# EasyEDA Pro project REF_Base.eprj

# Schematic Schematic1
Create Date: 2024-08-08; Page Name: P1; Project Name: REF_Base; Schematic Name: Schematic1; Update Date: 2024-08-25; Company: 嘉立创EDA; Drawed: XiaoHai; Page Size: A4; Reviewed: XiaoHai; Version: V1.0
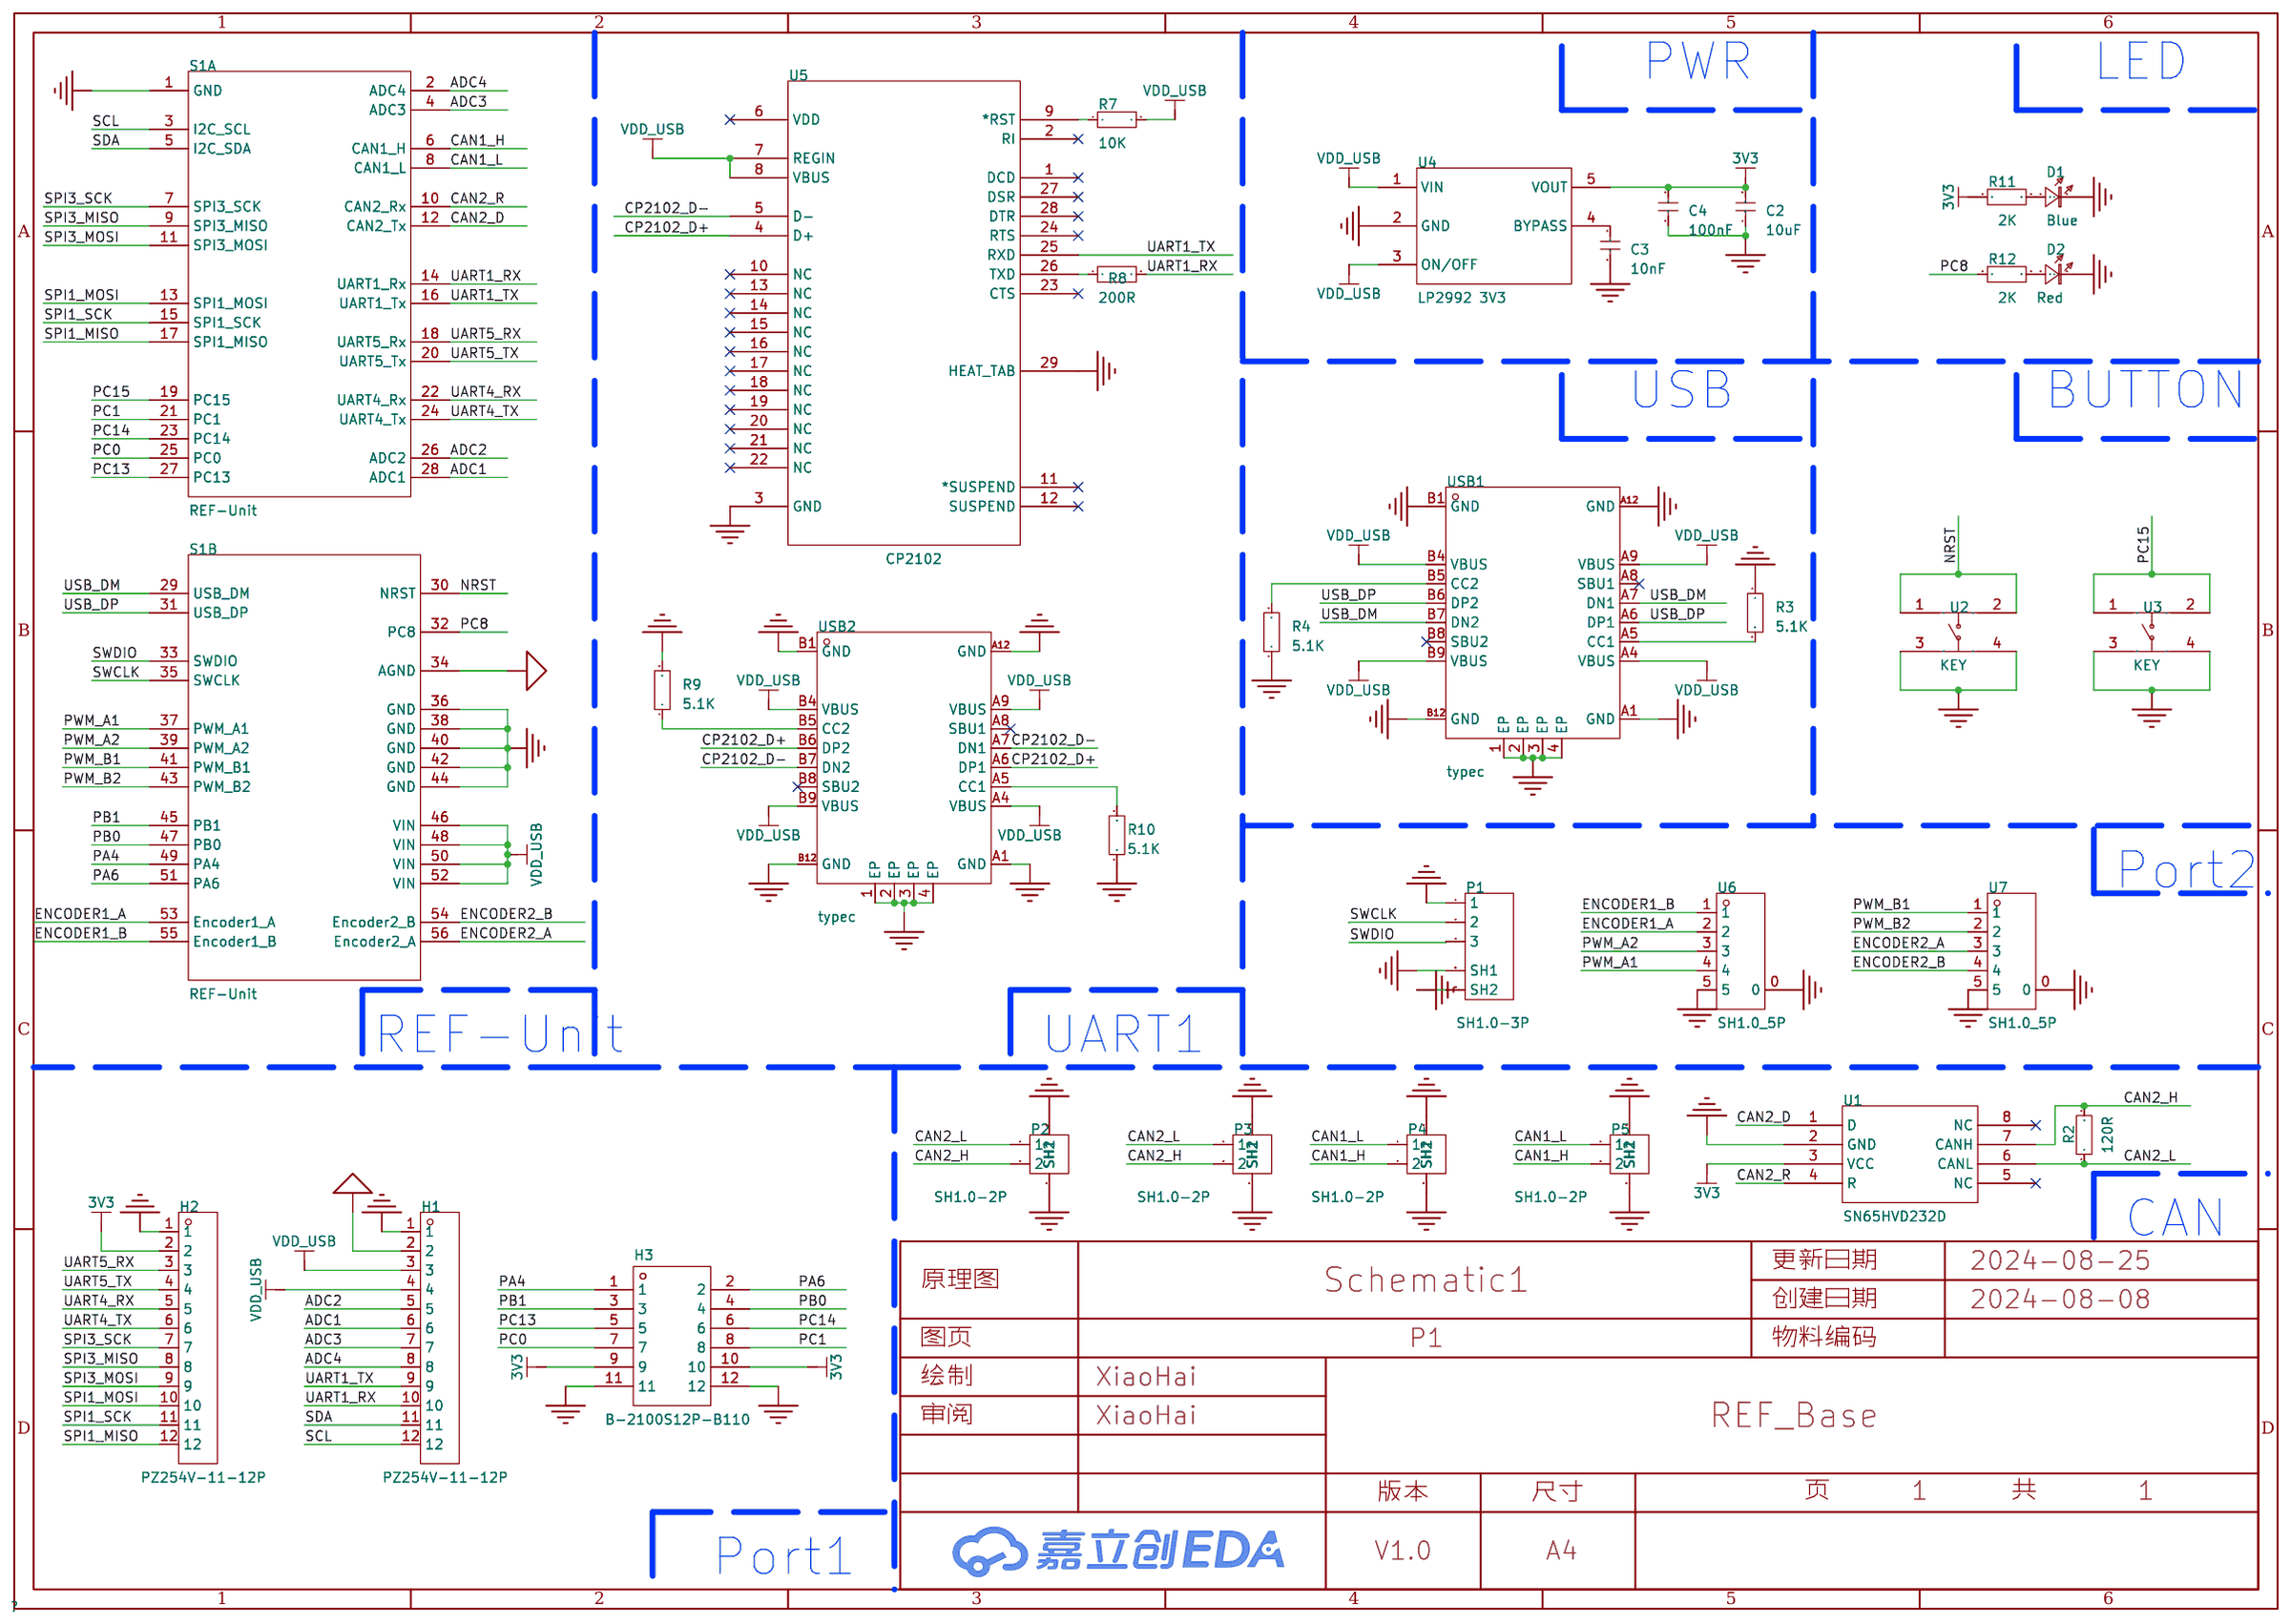
[diagram p0: schematic sheet]

## Parts
C2  0.1u  [CAP_0402]
C3  0.1u  [CAP_0402]
C4  0.1u  [CAP_0402]
D1  color?  [LED_0402_RED]
D2  color?  [LED_0402_RED]
H1  PZ254V-11-12P  [HDR-TH_12P-P2.54-V-M]
H2  PZ254V-11-12P  [HDR-TH_12P-P2.54-V-M]
H3  B-2100S12P-B110  [HDR-TH_12P-P2.54-V-M-R2-C6-S2.54]
P1  SH1.0-3P  [SH1.0-3P]
P2  SH1.0-2P  [SH1.0-2P]
P3  SH1.0-2P  [SH1.0-2P]
P4  SH1.0-2P  [SH1.0-2P]
P5  SH1.0-2P  [SH1.0-2P]
R2  22R  [RES_0402]
R3  22R  [RES_0402]
R4  22R  [RES_0402]
R7  22R  [RES_0402]
R8  22R  [RES_0402]
R9  22R  [RES_0402]
R10  22R  [RES_0402]
R11  22R  [RES_0402]
R12  22R  [RES_0402]
S1  REF-Unit  [REF-UNIT]  (sections 1,2)
U1  SN65HVD232D  [SO-8]
U2  KEY  [KEY-SMD_TSC4A]
U3  KEY  [KEY-SMD_TSC4A]
U4  LP2992 3V3  [SOT23-5]
U5  Value  [QFN-28]
U6  SH1.0_5P  [CONN-SMD_5P-SH1.00-5P-WT]
U7  SH1.0_5P  [CONN-SMD_5P-SH1.00-5P-WT]
USB1  typec  [USB-C-SMD_KH-TYPE-C-16P]
USB2  typec  [USB-C-SMD_KH-TYPE-C-16P]

## Library data of the parts
C2-C4 = 电容-0402
D1 D2 = LED_0402: Type: 0402; Origin Footprint 2: LED_0402_BLUE; Origin Footprint 3: LED_0402_ORANGE; Origin Footprint 4: LED_0402_YELLOW; Origin Footprint 5: LED_0402_GREEN
H1 H2 = PZ254V-11-12P: 插针结构:1x12P;间距:2.54mm;行距:-;圆针/方针:方针;安装类型:直插;排数:单排;总PIN位数:12P;额定电流:3A;额定电压:250V;配合针长度:6mm;塑高:2.5mm;端接针长度:3mm;触头材质:-;工作温度范围:-40℃~+105℃;颜色:黑色;; LCSC Part Name: 间距:2.54mm 1x12P 直插 方针; Supplier Part: C2840012; Manufacturer: XFCN(兴飞); Supplier Footprint: 插件,P=2.54mm; Datasheet: https://atta.szlcsc.com/upload/public/pdf/source/20200309/C492403_F9F19131791D08044AD4F84F8E751A34.pdf; Supplier: LCSC; Pin Structure: 1x12P; Pitch: 2.54mm; Circluar Pins/Square Pins: 方针; Mounting Type: 直插; Number of Rows: 单排; Number of Pins: 12P; Current Rating (Max): 3A; Voltage Rating (Max): 250V; Length of Mating Pin: 6mm; Insulation Height: 2.5mm; Length of End Connection Pin: 3mm; Operating Temperature Range: -40℃~+105℃; Color: 黑色
H3 = B-2100S12P-B110: 插针结构:2x6P;间距:2.54mm;行距:2.54mm;圆针/方针:-;安装类型:直插;排数:双排;总PIN位数:12P;额定电流:-;额定电压:-;配合针长度:6mm;塑高:2.54mm;端接针长度:3mm;触头材质:黄铜;触头镀层:-;工作温度范围:-40℃~+105℃;颜色:黑色;; LCSC Part Name: 间距:2.54mm 2x6P 直插; Supplier Part: C124388; Manufacturer: Ckmtw(灿科盟); Supplier Footprint: 插件,P=2.54mm; Datasheet: https://atta.szlcsc.com/upload/public/pdf/source/20180130/C169817_15172974075481323419.pdf; Supplier: LCSC; Pin Structure: 2x6P; Pitch: 2.54mm; Row Spacing: 2.54mm; Mounting Type: 直插; Number of Rows: 双排; Number of Pins: 12P; Length of Mating Pin: 6mm; Insulation Height: 2.54mm; Length of End Connection Pin: 3mm; Contact Material: 黄铜; Operating Temperature Range: -40℃~+105℃; Color: 黑色
P1 = SH1.0-3P
P2-P5 = SH1.0-2P
R2-R4 R7-R12 = 电阻-0402
S1 = REF-Unit: Origin Footprint 2: REF-UNIT-NO-BOARD
U1 = SN65HVD232D: Supplier 1: Digi-Key; Supplier Part Number 1: 296-26344-2-ND; Manufacturer: Texas Instruments; RoHS: RoHS Compliant; Category: Integrated Circuits (ICs); Stock: 5000; Pricing 1: 2500=0.84375 (USD); Packaging: Tape & Reel (TR); Part Status: Active; Type: Transceiver; Protocol: CAN; Number of Drivers/Receivers: 1/1; Duplex: Half; Data Rate: 1Mbps; Voltage - Supply: 3 V ~ 3.6 V; Operating Temperature: -40°C ~ 85°C; Mounting Type: Surface Mount; Package / Case: 8-SOIC (0.154", 3.90mm Width); Supplier Device Package: 8-SOIC; ComponentLink1URL: http://www.ti.com/lit/ds/symlink/sn65hvd230.pdf; ComponentLink1Description: http://www.ti.com/lit/ds/symlink/sn65hvd230.pdf; Supplier 2: Digi-Key; Supplier Part Number 2: 296-26344-1-ND; Pricing 2: 1=2.05, 10=1.842, 100=1.4809, 500=1.21668, 1000=1.00811 (USD); Manufacturer Part Number: SN65HVD232DR
U2 U3 = TSC4A 160gf-WZ 016: 电路结构:单刀单掷;按钮形状:矩形按钮;作用力:1.6N;安装方式:卧贴;开关长度:3.5mm;开关高度:1.5mm;触点电流:50mA;额定电压(DC):12V;绝缘电阻:100MΩ;机械寿命:10万次;; LCSC Part Name: 轻触开关 侧按四脚小龟 160gf无定位柱 贴膜; Supplier Part: C2906284; Manufacturer: SHOU HAN(首韩); Supplier Footprint: SMD; Datasheet: https://atta.szlcsc.com/upload/public/pdf/source/20211019/A30929F27AFADC19C8B53860DA406C04.pdf; Supplier: LCSC; Circuit: 单刀单掷; Actuator Style: 矩形按钮; Operating Force: 1.6N; Mounting Style: 卧贴; Switch Length: 3.5mm; Switch Height: 1.5mm; Contact Current: 50mA; Voltage Rating (DC): 12V; Insulation Resistance: 100MΩ; Actuator/Cap Color: 黑色; Pin Style: SMD接片; Mechanical Life: 10万次; Operating Temperature: -20℃~+70℃
U4 = LP2992
U5 = CP2102: MFG #1: SILICON LABS; PART DESC: SINGLE-CHIP USB TO UART BRIDGE, QFN28, RoHS.; Type: DEV
U6 U7 = SH1.0_5P: Supplier Part: C9900011810; JLCPCB Part Class: 扩展库; Supplier: LCSC
USB1 USB2 = typec: Supplier Part: C9900016956; Supplier Footprint: typec 12p; JLCPCB Part Class: 扩展库; Supplier: LCSC

## Nets
3V3: C2.2 C4.1 H2.2 H3.9 H3.10 R11.1 U1.3(VCC) U4.5(VOUT)
AGND: H1.2 S1.34(AGND)
GND: C2.1 C3.1 C4.2 D1.2(K) D2.2(K) H1.1 H2.1 H3.11 H3.12 P1.1 P1.SH1 P1.SH2 P2.SH1 P2.SH2 P3.SH1 P3.SH2 P4.SH1 P4.SH2 P5.SH1 P5.SH2 R3.1 R4.1 R9.2 R10.1 S1.1(GND) S1.36(GND) S1.38(GND) S1.40(GND) S1.42(GND) S1.44(GND) U1.2(GND) U2.3 U2.4 U3.3 U3.4 U4.2(GND) U5.3(GND) U5.29(HEAT_TAB) U6.0 U6.5 U7.0 U7.5 USB1.1(EP) USB1.2(EP) USB1.3(EP) USB1.4(EP) USB1.A1(GND) USB1.A12(GND) USB1.B1(GND) USB1.B12(GND) USB2.1(EP) USB2.2(EP) USB2.3(EP) USB2.4(EP) USB2.A1(GND) USB2.A12(GND) USB2.B1(GND) USB2.B12(GND)
VDD_USB: H1.3 H1.4 R7.2 S1.46(VIN) S1.48(VIN) S1.50(VIN) S1.52(VIN) U4.1(VIN) U4.3(ON/OFF) U5.7(REGIN) U5.8(VBUS) USB1.A4(VBUS) USB1.A9(VBUS) USB1.B4(VBUS) USB1.B9(VBUS) USB2.A4(VBUS) USB2.A9(VBUS) USB2.B4(VBUS) USB2.B9(VBUS)
ADC1: H1.6 S1.28(ADC1)
ADC2: H1.5 S1.26(ADC2)
ADC3: H1.7 S1.4(ADC3)
ADC4: H1.8 S1.2(ADC4)
CAN1_H: P4.2 P5.2 S1.6(CAN1_H)
CAN1_L: P4.1 P5.1 S1.8(CAN1_L)
CAN2_D: S1.12(CAN2_Tx) U1.1(D)
CAN2_H: P2.2 P3.2 R2.2 U1.7(CANH)
CAN2_L: P2.1 P3.1 R2.1 U1.6(CANL)
CAN2_R: S1.10(CAN2_Rx) U1.4(R)
CP2102_D+: U5.4(D+) USB2.A6(DP1) USB2.B6(DP2)
CP2102_D-: U5.5(D-) USB2.A7(DN1) USB2.B7(DN2)
ENCODER1_A: S1.53(Encoder1_A) U6.2
ENCODER1_B: S1.55(Encoder1_B) U6.1
ENCODER2_A: S1.56(Encoder2_A) U7.3
ENCODER2_B: S1.54(Encoder2_B) U7.4
NRST: S1.30(NRST) U2.1 U2.2
PA4: H3.1 S1.49(PA4)
PA6: H3.2 S1.51(PA6)
PB0: H3.4 S1.47(PB0)
PB1: H3.3 S1.45(PB1)
PC0: H3.7 S1.25(PC0)
PC1: H3.8 S1.21(PC1)
PC8: R12.1 S1.32(PC8)
PC13: H3.5 S1.27(PC13)
PC14: H3.6 S1.23(PC14)
PC15: S1.19(PC15) U3.1 U3.2
PWM_A1: S1.37(PWM_A1) U6.4
PWM_A2: S1.39(PWM_A2) U6.3
PWM_B1: S1.41(PWM_B1) U7.1
PWM_B2: S1.43(PWM_B2) U7.2
SCL: H1.12 S1.3(I2C_SCL)
SDA: H1.11 S1.5(I2C_SDA)
SPI1_MISO: H2.12 S1.17(SPI1_MISO)
SPI1_MOSI: H2.10 S1.13(SPI1_MOSI)
SPI1_SCK: H2.11 S1.15(SPI1_SCK)
SPI3_MISO: H2.8 S1.9(SPI3_MISO)
SPI3_MOSI: H2.9 S1.11(SPI3_MOSI)
SPI3_SCK: H2.7 S1.7(SPI3_SCK)
SWCLK: P1.2 S1.35(SWCLK)
SWDIO: P1.3 S1.33(SWDIO)
UART1_RX: H1.10 R8.2 S1.14(UART1_Rx)
UART1_TX: H1.9 S1.16(UART1_Tx) U5.25(RXD)
UART4_RX: H2.5 S1.22(UART4_Rx)
UART4_TX: H2.6 S1.24(UART4_Tx)
UART5_RX: H2.3 S1.18(UART5_Rx)
UART5_TX: H2.4 S1.20(UART5_Tx)
USB_DM: S1.29(USB_DM) USB1.A7(DN1) USB1.B7(DN2)
USB_DP: S1.31(USB_DP) USB1.A6(DP1) USB1.B6(DP2)
$1N7194: R4.2 USB1.B5(CC2)
$1N7198: R3.2 USB1.A5(CC1)
$1N7820: C3.2 U4.4(BYPASS)
$1N8064: R7.1 U5.9(*RST)
$1N8083: R8.1 U5.26(TXD)
$1N8290: R9.1 USB2.B5(CC2)
$1N8294: R10.2 USB2.A5(CC1)
$1N8566: D1.1(A) R11.2
$1N8614: D2.1(A) R12.2

Not connected (* = marked no-connect by the designer): U1 5(NC)* 8(NC)*; U5 1(DCD)* 2(RI)* 6(VDD)* 10(NC)* 11(*SUSPEND)* 12(SUSPEND)* 13(NC)* 14(NC)* 15(NC)* 16(NC)* 17(NC)* 18(NC)* 19(NC)* 20(NC)* 21(NC)* 22(NC)* 23(CTS)* 24(RTS)* 27(DSR)* 28(DTR)*; USB1 A8(SBU1)* B8(SBU2)*; USB2 A8(SBU1)* B8(SBU2)*

## Notes on the sheet
- PWR
- LED
- USB
- BUTTON
- Port2
- REF-Unit
- UART1
- CAN
- Port1

# Board PCB1
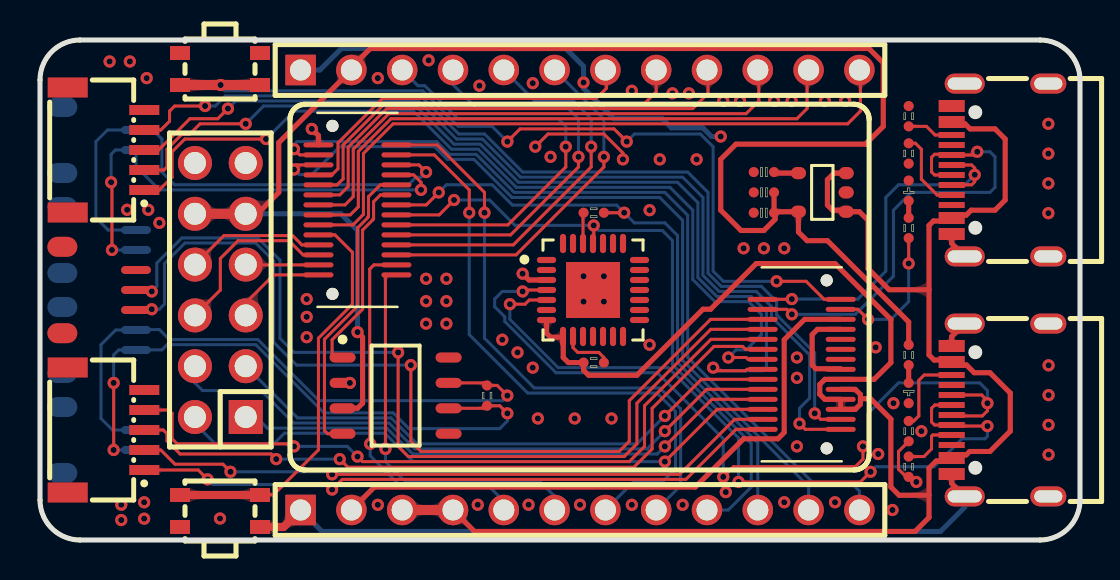
[diagram p1: board, top side]
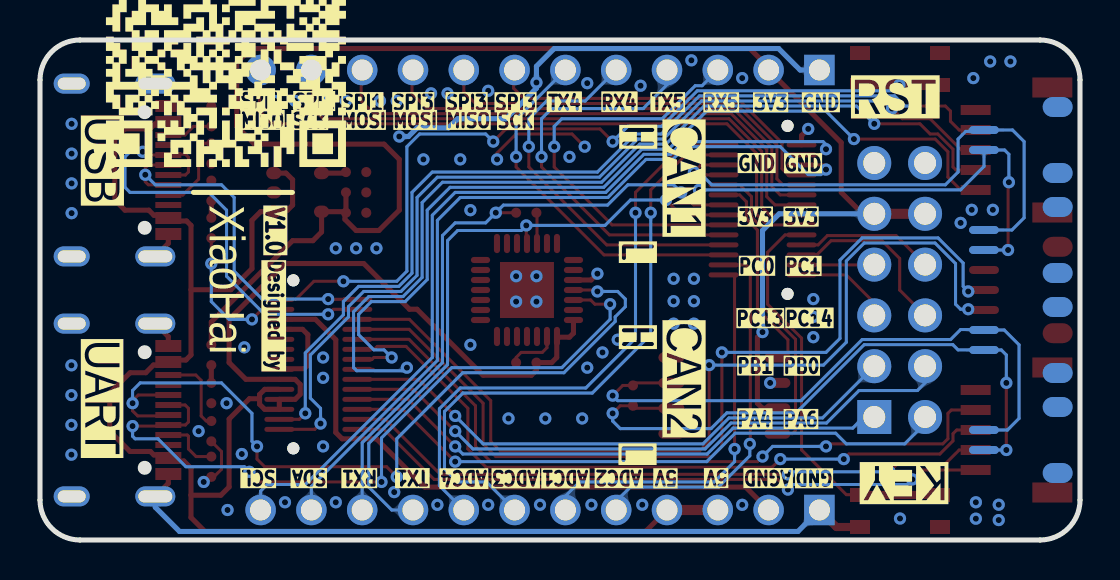
[diagram p2: board, bottom side, seen from below]

Outline 52 x 25 mm; copper layers: Top Layer, Bottom Layer. Coordinates in mm from the lower left corner of the outline.
Outline path: 0,23 0,2 arc(0.59,0.59) 2,0 50,0 arc(51.41,0.59) 52,2 52,23 arc(51.41,24.41) 50,25 2,25 arc(0.59,24.41) 0,23
Stack: Top Layer 0.035mm / Dielectric1 1.51mm FR4 er 4.5 / Bottom Layer 0.035mm

## Design rules (mm)
template: 自定义配置
spacing copperThickness1oz (default): track to track 0.102, other pairs 0.152 to 0.3
spacing copperThickness2oz: track to track 0.203, other pairs 0.152 to 0.3
track width copperThickness1oz (default): min 0.127, default 0.254, max 2.54
track width copperThickness2oz: min 0.203, default 0.254, max 2.54
differential pair differentialPair (default): width min 0.127, default 0.254, max 2.54; gap min 0.152, default 0.152
via viaSize (default): diameter min 0.457, default 0.457, max 10; hole min 0.254, default 0.254, max 6.3

## Placement (name value [footprint] x y rotation side)
C2  0.1u  [CAP_0402]  36.19 16.36 0 top
C3  0.1u  [CAP_0402]  36.19 18.4 0 top
C4  0.1u  [CAP_0402]  36.19 17.38 180 top
D1  color?  [LED_0402_RED]  43.43 7.35 270 top
D2  color?  [LED_0402_RED]  43.43 17.46 90 top
H1  PZ254V-11-12P  [HDR-TH_12P-P2.54-V-M]  27 1.5 0 top
H2  PZ254V-11-12P  [HDR-TH_12P-P2.54-V-M]  27 23.5 0 top
H3  B-2100S12P-B110  [HDR-TH_12P-P2.54-V-M-R2-C6-S2.54]  9.02 12.5 90 top
P1  -  [SH1.0-3P]  4.8 12.5 270 top
P2  -  [SH1.0-2P]  4.8 5 90 bottom
P3  -  [SH1.0-2P]  4.8 10 90 bottom
P4  -  [SH1.0-2P]  4.8 15 90 bottom
P5  -  [SH1.0-2P]  4.8 20 90 bottom
R2  22R  [RES_0402]  22.35 7.22 90 top
R3  22R  [RES_0402]  43.43 19.33 90 top
R4  22R  [RES_0402]  43.43 21.19 270 top
R7  22R  [RES_0402]  27.69 8.87 180 top
R8  22R  [RES_0402]  27.69 16.36 0 top
R9  22R  [RES_0402]  43.43 5.44 270 top
R10  22R  [RES_0402]  43.43 3.66 90 top
R11  22R  [RES_0402]  43.43 9.25 270 top
R12  22R  [RES_0402]  43.43 15.6 90 top
S1  REF-Unit  [REF-UNIT]  12.5 3.5 0 top
U1  SN65HVD232D  [SO-8]  17.78 7.22 0 top
U2  KEY  [KEY-SMD_TSC4A]  9 23.55 180 top
U3  KEY  [KEY-SMD_TSC4A]  9 1.45 0 top
U4  LP2992 3V3  [SOT23-5]  39.12 17.38 180 top
U5  Value  [QFN-28]  27.65 12.5 0 top
U6  SH1.0_5P  [CONN-SMD_5P-SH1.00-5P-WT]  3.3 5.5 270 top
U7  SH1.0_5P  [CONN-SMD_5P-SH1.00-5P-WT]  3.3 19.5 270 top
USB1  typec  [USB-C-SMD_KH-TYPE-C-16P]  48 18.5 90 top
USB2  typec  [USB-C-SMD_KH-TYPE-C-16P]  48 6.5 90 top

## Footprints (pads in the part's own frame, mm; a bottom-side part is the same pattern mirrored in y, then rotated)
CAP_0402
  rrect 0.508x0.508 smd: 1(-0.508,0) 2(0.508,0)
CONN-SMD_5P-SH1.00-5P-WT
  rect 1x2 smd: 0(-3.125,-1.915) 0(3.125,-1.915)
  rect 0.5x1.5 smd: 1(2,1.915) 2(1,1.915) 3(0,1.915) 4(-1,1.915) 5(-2,1.915)
HDR-TH_12P-P2.54-V-M
  rect 1.524x1.524 hole 1.05: 1(-13.97,0)
  round 1.524 hole 1.05: 2(-11.43,0) 3(-8.89,0) 4(-6.35,0) 5(-3.81,0) 6(-1.27,0) 7(1.27,0) 8(3.81,0) 9(6.35,0) 10(8.89,0) 11(11.43,0) 12(13.97,0)
HDR-TH_12P-P2.54-V-M-R2-C6-S2.54
  rect 1.7x1.7 hole 1.1: 1(-6.35,-1.27)
  round 1.7 hole 1.1: 2(-6.35,1.27) 3(-3.81,-1.27) 4(-3.81,1.27) 5(-1.27,-1.27) 6(-1.27,1.27) 7(1.27,-1.27) 8(1.27,1.27) 9(3.81,-1.27) 10(3.81,1.27) 11(6.35,-1.27) 12(6.35,1.27)
KEY-SMD_TSC4A
  rect 1x0.7 smd: 1(-2,0.8) 2(2,0.8) 3(-2,-0.8) 4(2,-0.8)
LED_0402_RED
  rrect 0.508x0.508 smd: 1(-0.508,0) 2(0.508,0)
QFN-28
  rrect 0.965x0.305 smd: 1(-2.324,1.5) 2(-2.324,1) 3(-2.324,0.5) 4(-2.324,0) 5(-2.324,-0.5) 6(-2.324,-1) 7(-2.324,-1.5) 15(2.324,-1.5) 16(2.324,-1) 17(2.324,-0.5) 18(2.324,0) 19(2.324,0.5) 20(2.324,1) 21(2.324,1.5)
  rrect 0.305x0.965 smd: 8(-1.5,-2.324) 9(-1,-2.324) 10(-0.5,-2.324) 11(0,-2.324) 12(0.5,-2.324) 13(1,-2.324) 14(1.5,-2.324) 22(1.5,2.324) 23(1,2.324) 24(0.5,2.324) 25(0,2.324) 26(-0.5,2.324) 27(-1,2.324) 28(-1.5,2.324)
  rect 2.7x2.8 smd: 29(0,0)
REF-UNIT
  rrect 1.5x0.25 smd: 1(1.423,16.256) 2(5.322,16.256) 3(1.423,15.755) 4(5.322,15.755) 5(1.423,15.255) 6(5.322,15.255) 7(1.423,14.755) 8(5.322,14.755) 9(1.423,14.255) 10(5.322,14.255) 11(1.423,13.755) 12(5.322,13.755) 13(1.423,13.255) 14(5.322,13.255) 15(1.423,12.755) 16(5.322,12.755) 17(1.423,12.255) 18(5.322,12.255) 19(1.423,11.755) 20(5.322,11.755) 21(1.423,11.255) 22(5.322,11.255) 23(1.423,10.755) 24(5.322,10.755) 25(1.423,10.255) 26(5.322,10.255) 27(1.423,9.755) 28(5.322,9.755) 29(23.634,8.533) 30(27.534,8.533) 31(23.634,8.033) 32(27.534,8.033) 33(23.634,7.532) 34(27.534,7.532) 35(23.634,7.032) 36(27.534,7.032) 37(23.634,6.532) 38(27.534,6.532) 39(23.634,6.032) 40(27.534,6.032) 41(23.634,5.532) 42(27.534,5.532) 43(23.634,5.032) 44(27.534,5.032) 45(23.634,4.532) 46(27.534,4.532) 47(23.634,4.032) 48(27.534,4.032) 49(23.634,3.533) 50(27.534,3.533) 51(23.634,3.033) 52(27.534,3.033) 53(23.634,2.533) 54(27.534,2.533) 55(23.634,2.033) 56(27.534,2.033)
  round 0.6 hole 0.9: 57(2.123,17.206) 58(2.123,8.806) 59(26.834,1.082) 60(26.834,9.482)
RES_0402
  rrect 0.508x0.508 smd: 1(-0.508,0) 2(0.508,0)
SH1.0-2P
  rrect 0.4x1.5 smd: 1(-0.5,0) 2(0.5,0)
  rrect 1x1.5 smd: SH1(-1.651,-3.683) SH2(1.651,-3.683)
SH1.0-3P
  rrect 0.4x1.5 smd: 1(-1,0) 2(0,0) 3(1,0)
  rrect 1x1.5 smd: SH1(-2.159,-3.683) SH2(2.159,-3.683)
SO-8
  oval 1.3x0.5 smd: 1(-2.65,1.905) 2(-2.65,0.635) 3(-2.65,-0.635) 4(-2.65,-1.905) 5(2.65,-1.905) 6(2.65,-0.635) 7(2.65,0.635) 8(2.65,1.905)
SOT23-5
  rrect 0.762x0.61 smd: 1(-1.194,0.965) 2(-1.194,0) 3(-1.194,-0.965) 4(1.194,-0.965) 5(1.194,0.965)
USB-C-SMD_KH-TYPE-C-16P
  oval 1x2 hole 0.6x1.7: 1(-4.32,1.765) 2(4.32,1.765)
  oval 1x1.8 hole 0.6x1.4: 3(-4.32,-2.415) 4(4.32,-2.415)
  rect 0.3x1.3 smd: A1(-3.35,2.415) A4(-2.55,2.415) A5(-1.25,2.415) A6(-0.25,2.415) A7(0.25,2.415) A8(1.25,2.415) A9(2.55,2.415) A12(3.35,2.415) B1(3.05,2.415) B4(2.25,2.415) B5(1.75,2.415) B6(0.75,2.415) B7(-0.75,2.415) B8(-1.75,2.415) B9(-2.25,2.415) B12(-3.05,2.415)

## Nets
As in the schematic.

Pads without a net: S1 57 58 59 60; U1 5 8; U5 1 2 6 10 11 12 13 14 15 16 17 18 19 20 21 22 23 24 27 28; USB1 A8 B8; USB2 A8 B8

## Via types
v1: diameter 0.61, hole 0.305, Top Layer to Bottom Layer, 149 vias

## Routing (per net, layer and track width the routed paths; a pad name or vN(x,y) marks a point on that pad's centre or on a via; arc(x,y) is an arc through that point)
3V3: length 85.5
  Top Layer w0.254: v1(15.88,10.39) 16.13,10.14 16.13,6.84 15.88,6.58 U1.3 ; 36.75,16.42 36.75,16.03 36.19,15.47 35.05,15.47 34.04,16.49 34.04,19.03 34.8,19.79 41.28,19.79 42.16,20.68 42.16,23.86 41.45,24.57 16.51,24.57 15.57,23.63 H2.2 11.94,19.87 11.94,17.38 10.87,16.31 H3.9 ; 36.75,16.42 37.92,16.42 37.92,15.4 38.35,14.97 39.37,14.97 43.43,10.9 R11.1 ; 36.75,16.42 C2.2 C4.1
  Top Layer w0.508: H3.10 H3.9
  Bottom Layer w0.254: H3.9 15.04,16.31 15.88,15.47 v1(15.88,10.39)
AGND: length 31.1
  Top Layer w0.254: H1.2 16.72,2.65 32.77,2.65 35.18,5.06 36.9,5.06 37.21,5.38 37.21,10.01 38.23,11.03 S1.34
GND: length 79.2
  Top Layer w0.152: R10.1 43.31,3.16 42.93,3.54 42.93,4.43 R9.2 ; v1(29.15,19.03) 29.15,19.35 28.19,20.3 25.4,20.3 v1(24.76,19.67)
  Top Layer w0.254: S1.1 13.92,20.22 v1(13.59,20.56) ; USB2.1 45.59,2.83 USB2.A1 ; USB1.1 45.59,14.83 USB1.A1 ; USB2.A12 45.59,10.17 USB2.2 ; U5.3 24.45,13 v1(24.13,13.32) ; S1.36 38.87,10.53 38.61,10.27 38.61,8.74 38.79,8.56 40,8.56 S1.44
  Top Layer w0.406: U3.4 12.18,0.65 H1.1
  Bottom Layer w0.254: H2.1 13.99,23.5 15.07,24.57 26.29,24.57 27.18,23.68 27.18,22.59 28.7,21.06 31.12,21.06 31.57,20.61 33.15,20.61 33.58,20.17 v1(34.04,20.17) ; H1.1 14.1,0.43 45.02,0.43 46.24,1.64 USB2.1
  vias: v1(3.48,23.93) v1(4.06,1.77) v1(4.06,1) v1(4.36,16.51) v1(4.49,23.93) v1(5.21,1.89) v1(5.21,1.07) v1(5.33,23.09) v1(5.41,16.51) v1(5.97,15.86) v1(9,1.07) v1(13.34,12.05) v1(13.34,11.16) v1(13.34,10.14) v1(15.49,7.86) v1(16.89,23.09) v1(16.89,1.76) v1(19.3,13.06) v1(19.3,11.94) v1(19.3,10.82) v1(19.43,23.98) v1(20.32,13.06) v1(20.32,11.94) v1(20.32,10.82) v1(21.89,1.76) v1(21.97,22.71) v1(23.11,10.01) v1(23.88,9.38) v1(24.43,1.76) v1(24.64,22.84) v1(24.64,8.62) v1(24.89,6.08) v1(25.53,19.16) v1(26.73,6.08) v1(27,1.76) v1(27.18,22.87) v1(27.18,13.19) v1(27.18,11.92) v1(28.19,13.19) v1(28.19,11.92) v1(28.57,6.08) v1(29.59,22.46) v1(29.59,1.76) v1(30.48,16.49) v1(30.48,9.76) v1(30.99,19.03) v1(31.62,22.33) v1(32.13,1.76) v1(32.45,22.33) v1(32.83,19.03) v1(34.16,21.95) v1(34.29,2.39) v1(35,21.95) v1(35.18,14.59) v1(36.19,14.59) v1(36.7,21.95) v1(37.21,14.59) v1(37.21,1.89) v1(37.58,21.95) v1(37.85,9.12) v1(37.85,8.11) v1(37.85,4.68) v1(39.24,21.95) v1(39.75,1.89) v1(40.26,21.95) v1(41.78,9.63) v1(41.91,4.3) v1(42.62,1.5) v1(42.67,6.84) v1(43.81,2.9) v1(44.07,5.44) v1(50.42,20.81) v1(50.42,19.32) v1(50.42,17.83) v1(50.42,16.34) v1(50.43,8.73) v1(50.43,7.24) v1(50.43,5.76) v1(50.43,4.27)
VDD_USB: length 110.3
  Top Layer w0.254: U4.3 39.7,18.34 39.37,18.02 39.37,16.75 39.62,16.49 40.23,16.49 40.31,16.42 40.97,16.42 41.4,15.98 41.4,13.57 42.46,12.51 44.45,12.51 ; USB1.A4 44.67,15.95 44.45,15.73 44.45,12.51 ; USB1.A4 USB1.B9 ; USB1.A4 45.87,16.24 46.31,16.24 46.56,16.49 47.75,16.49 48.26,17 48.26,20.05 47.75,20.56 46.5,20.56 46.25,20.81 45.83,20.81 USB1.A9 ; 41.02,7.06 41.02,7.28 40.77,7.53 S1.48 ; 41.02,7.06 41.02,6.79 40.77,6.53 S1.52 S1.50 39.24,7.03 38.99,7.29 38.99,7.78 39.24,8.03 S1.46 41.71,8.03 42.54,8.87 42.54,11.03 39.75,13.82 35.81,13.82 33.53,11.54 33.15,11.54 29.84,8.24 27.43,8.24 27.18,8.49 R7.2 26.42,8.87 26.16,9.12 26.16,10.17 U5.8 26.12,10.14 25.53,10.14 25.33,10.34 U5.7 ; 41.02,7.06 41.53,7.06 42.54,6.05 42.54,2.65 42.95,2.24 44.45,2.24 ; 44.45,2.24 44.45,1.12 43.75,0.43 21.72,0.43 H1.4 ; 44.45,2.24 44.45,3.59 44.81,3.95 USB2.A4 ; USB2.B4 46.32,8.75 46.71,8.36 47.5,8.36 48.51,7.35 48.51,5.44 47.5,4.43 46.48,4.43 46.31,4.25 USB2.B9 ; 44.45,12.51 44.45,9.25 44.7,9 45.53,9 USB2.A9
  Top Layer w0.508: H1.4 H1.3
ADC1: length 19.9
  Top Layer w0.152: v1(17.27,4.55) 17.27,13.15 17.17,13.26 S1.28
  Bottom Layer w0.152: H1.6 25.73,2.19 25.02,2.9 18.29,2.9 17.27,3.92 v1(17.27,4.55)
ADC2: length 18.8
  Top Layer w0.152: S1.26 16.7,13.76 16.48,13.54 16.48,4.83 v1(16.51,4.81)
  Bottom Layer w0.152: v1(16.51,4.81) 16.51,4.21 18.07,2.65 22.48,2.65 23.19,1.94 H1.5
ADC3: length 30.7
  Top Layer w0.152: S1.4 19.71,19.26 21.46,17.51 v1(21.46,16.36)
  Bottom Layer w0.152: H1.7 29.67,2.9 31.12,2.9 31.78,3.56 31.78,6.42 30.85,7.35 24.38,7.35 21.46,10.27 v1(21.46,16.36)
ADC4: length 29.5
  Top Layer w0.152: S1.2 19.85,19.76 22.22,17.38 v1(22.22,16.36)
  Bottom Layer w0.152: H1.8 32.03,2.72 32.03,6.56 30.99,7.6 24.71,7.6 22.22,10.08 v1(22.22,16.36)
CAN1_H: length 26.8
  Top Layer w0.152: S1.6 18.94,18.76 v1(19.3,18.4)
  Bottom Layer w0.152: P4.2 3.4,15.5 2.79,16.11 2.79,19.92 3.37,20.5 P5.2 4.87,20.43 5.72,20.43 6.1,20.05 6.1,18.4 6.73,17.76 18.41,17.76 18.8,18.14 19.05,18.14 v1(19.3,18.4)
CAN1_L: length 24.7
  Top Layer w0.152: v1(3.6,14.5) 3.6,17.85 v1(3.56,17.89) ; v1(19.05,17.51) 19.05,17.89 18.68,18.26 S1.8
  Bottom Layer w0.152: P4.1 v1(3.6,14.5) 3.56,14.46 ; v1(3.56,17.89) 3.56,19.28 3.77,19.5 P5.1 4.8,18.68 5.97,17.51 v1(19.05,17.51)
CAN2_D: length 10.4
  Top Layer w0.152: U1.1 14.73,9.12 14.6,9.25 14.6,10.01 16.13,11.54 16.13,15.5 16.64,16 16.64,16.02 16.68,16.05 16.68,16.91 17.02,17.26 S1.12
CAN2_H: length 31.1
  Top Layer w0.152: v1(23.37,7.22) 22.86,7.73 R2.2 22.22,7.86 U1.7
  Bottom Layer w0.152: v1(23.37,7.22) 23.11,6.97 13.95,6.97 10.89,10.02 6.47,10.02 5.97,10.52 4.82,10.52 P3.2 3.79,10.5 3.05,9.76 3.05,6.08 3.62,5.5 P2.2
CAN2_L: length 31.2
  Top Layer w0.152: v1(23.37,6.33) 22.99,6.71 R2.1 22.22,6.58 U1.6 ; v1(3.68,4.5) v1(3.68,7.86)
  Bottom Layer w0.152: v1(23.37,6.33) 23.37,5.95 22.99,5.57 18.45,5.57 17.66,6.36 14.2,6.36 10.79,9.77 6.36,9.77 6.1,9.51 4.81,9.51 P3.1 3.93,9.5 3.68,9.25 v1(3.68,7.86) ; P2.1 v1(3.68,4.5)
CAN2_R: length 15.2
  Top Layer w0.152: S1.10 17.01,17.76 16.43,17.17 16.43,16.17 16.38,16.14 16.38,16.11 15.88,15.6 15.88,11.69 14.22,10.04 14.22,5.47 14.38,5.31 U1.4
CP2102_D+: length 40.8
  Top Layer w0.152: v1(41.15,4.68) 41.15,4.05 40.77,3.66 34.67,3.66 v1(34.16,3.16) ; USB2.B6 47.09,7.25 47.37,6.97 v1(47.37,6.84) 47.37,6.46 47.12,6.2 45.63,6.2 USB2.A6 ; v1(24.13,12.43) 24.2,12.5 U5.4
  Bottom Layer w0.152: v1(24.13,12.43) 23.11,12.43 22.73,12.05 22.73,11.67 23.24,11.16 23.24,10.92 25.8,8.36 30.86,8.36 34.16,5.06 v1(34.16,3.16) ; v1(47.37,6.84) 47.37,7.47 46.99,7.86 42.93,7.86 41.4,6.33 41.4,4.93 v1(41.15,4.68)
CP2102_D-: length 37.3
  Top Layer w0.152: USB2.A7 44.74,6.75 44.58,6.58 44.58,5.9 44.73,5.75 USB2.B7 45.64,5.7 v1(47.37,5.7) ; v1(34.93,2.9) 41.02,2.9 v1(41.53,3.41) ; v1(23.5,11.79) 24.26,11.79 24.47,12 U5.5
  Bottom Layer w0.152: v1(47.37,5.7) 47.37,5.19 47.24,5.06 46.1,5.06 44.7,3.66 41.78,3.66 v1(41.53,3.41) ; v1(34.93,2.9) 34.93,5.1 31.41,8.62 25.91,8.62 23.5,11.03 v1(23.5,11.79)
ENCODER1_A: length 32.6
  Top Layer w0.152: v1(9.53,3.41) 9.14,3.79 6.75,3.79 6.04,4.5 U6.2 ; v1(14.6,3.28) 31.98,3.28 34.73,6.03 S1.53
  Bottom Layer w0.152: v1(9.53,3.41) 14.48,3.41 v1(14.6,3.28)
ENCODER1_B: length 32.6
  Top Layer w0.152: v1(14.6,2.52) 15.11,3.03 32.29,3.03 34.8,5.53 S1.55 ; v1(8.38,3.03) 7.91,3.5 U6.1
  Bottom Layer w0.152: v1(8.38,3.03) 8.64,2.78 14.35,2.78 v1(14.6,2.52)
ENCODER2_A: length 47.9
  Top Layer w0.152: U7.3 5.93,19.5 7.49,21.06 8.89,21.06 v1(9.4,21.57) ; S1.56 38.26,5.53 v1(37.97,5.82)
  Bottom Layer w0.152: v1(9.4,21.57) 9.78,21.95 18.92,21.95 20.83,20.05 22.12,20.05 24.03,18.14 32.13,18.14 33.15,17.13 33.15,13.23 33.95,12.43 35.81,12.43 36.58,11.67 36.58,11.15 38.48,9.25 38.48,7.09 37.97,6.58 v1(37.97,5.82)
ENCODER2_B: length 47
  Top Layer w0.152: v1(8.25,21.7) 6.73,21.7 6.48,21.44 6.48,20.94 6.04,20.5 U7.4 ; S1.54 39.03,6.03 v1(38.74,6.33)
  Bottom Layer w0.152: v1(8.25,21.7) 8.76,21.7 9.27,22.21 19.03,22.21 20.93,20.3 22.22,20.3 24.13,18.4 32.38,18.4 33.4,17.38 33.4,13.34 34.06,12.68 36.07,12.68 36.83,11.92 36.83,11.26 38.74,9.35 v1(38.74,6.33)
NRST: length 44
  Top Layer w0.152: v1(23.37,19.92) 24,20.56 28.7,20.56 v1(29.34,19.92) ; v1(36.83,12.94) 38.31,12.94 39.21,12.03 S1.30
  Top Layer w0.508: U2.2 v1(9.03,22.75) U2.1
  Bottom Layer w0.152: v1(29.34,19.92) 29.72,20.3 33.02,20.3 33.66,19.67 33.66,13.44 34.16,12.94 v1(36.83,12.94) ; v1(9.03,22.75) 9.03,22.66 9.23,22.46 19.13,22.46 20.91,20.68 22.61,20.68 v1(23.37,19.92)
PA4: length 27.7
  Top Layer w0.152: S1.49 33.59,7.03 v1(31.24,4.68)
  Bottom Layer w0.152: H3.1 10.81,6.15 11.37,5.59 17.34,5.59 18.64,4.3 30.86,4.3 v1(31.24,4.68)
PA6: length 31
  Top Layer w0.152: v1(31.24,3.92) 33.86,6.53 S1.51
  Bottom Layer w0.152: v1(31.24,3.92) 18.66,3.92 17.24,5.34 12.22,5.34 11.68,4.81 8.76,4.81 7.75,5.82 H3.2
PB0: length 31.8
  Top Layer w0.152: S1.47 33.33,7.53 v1(31.24,5.44)
  Bottom Layer w0.152: v1(31.24,5.44) 30.35,4.55 18.75,4.55 17.45,5.85 12.67,5.85 11.05,7.47 8.13,7.47 7.75,7.86 H3.4
PB1: length 28.8
  Top Layer w0.152: v1(31.24,6.2) 33.07,8.03 S1.45
  Bottom Layer w0.152: v1(31.24,6.2) 29.84,4.81 18.85,4.81 17.55,6.1 12.87,6.1 H3.3
PC0: length 3.6
  Top Layer w0.152: S1.25 10.3,13.76 H3.7
PC1: length 7
  Top Layer w0.152: H3.8 9.2,15.22 12.63,15.22 13.1,14.76 S1.21
PC8: length 7.2
  Top Layer w0.152: S1.32 40.9,11.53 v1(41.4,11.03) ; R12.1 v1(43.43,13.82)
  Bottom Layer w0.152: v1(43.43,13.82) 43.43,11.92 42.54,11.03 v1(41.4,11.03)
PC13: length 4.8
  Top Layer w0.152: S1.27 11.68,13.26 10.29,11.86 H3.5
PC14: length 8.9
  Top Layer w0.152: H3.6 9.02,12.5 9.02,14.08 9.91,14.97 12.45,14.97 13.16,14.26 S1.23
PC15: length 20.5
  Top Layer w0.152: U3.2 11.02,2.27 11.68,2.27 13.92,4.51 13.92,10.09 15.62,11.79 15.62,14.38 14.75,15.26 S1.19
  Top Layer w0.406: U3.1 U3.2
PWM_A1: length 36.5
  Top Layer w0.152: v1(12.7,4.68) 12.57,4.81 6.86,4.81 6.6,5.06 6.6,6.33 6.44,6.5 U6.4 ; v1(15.88,4.17) 16.13,3.92 29.46,3.92 30.23,4.68 30.23,6.71 33.55,10.03 S1.37
  Bottom Layer w0.152: v1(15.88,4.17) 15.37,4.68 v1(12.7,4.68)
PWM_A2: length 35.7
  Top Layer w0.152: v1(14.99,4.05) 15.39,3.64 29.69,3.64 30.61,4.55 30.61,6.58 33.7,9.68 35.13,9.68 35.28,9.53 S1.39 ; v1(11.81,4.05) 11.56,4.3 7.01,4.3 6.35,4.96 6.35,5.31 6.17,5.5 U6.3
  Bottom Layer w0.152: v1(11.81,4.05) v1(14.99,4.05)
PWM_B1: length 44.4
  Top Layer w0.152: v1(34.42,9.12) 35.31,9.12 35.4,9.03 S1.41 ; U7.1 5.96,17.5 6.6,18.14 6.6,19.41 7.24,20.05 v1(11.3,20.05)
  Bottom Layer w0.152: v1(11.3,20.05) 12.7,21.44 18.67,21.44 20.57,19.54 21.91,19.54 23.81,17.63 31.5,17.63 32.64,16.49 32.64,13.02 33.74,11.92 35.43,11.92 36.07,11.28 36.07,10.27 35.31,9.51 34.8,9.51 v1(34.42,9.12)
PWM_B2: length 47.6
  Top Layer w0.152: S1.43 35.35,8.53 35.28,8.46 33.81,8.46 v1(33.66,8.62) ; U7.2 6.2,18.5 6.35,18.65 6.35,19.54 7.11,20.3 7.49,20.3 8,20.81 v1(10.29,20.81)
  Bottom Layer w0.152: v1(33.66,8.62) 33.81,8.46 36.17,8.46 36.32,8.62 36.32,11.41 35.56,12.17 33.85,12.17 32.89,13.13 32.89,16.87 31.88,17.89 23.92,17.89 22.01,19.79 20.7,19.79 18.8,21.7 11.18,21.7 v1(10.29,20.81)
SCL: length 42.3
  Top Layer w0.152: S1.3 12.98,19.26 v1(12.7,19.54)
  Bottom Layer w0.152: H1.12 40.97,2.44 40.64,2.78 38.74,2.78 32.38,9.12 32.38,16.24 31.24,17.38 23.71,17.38 21.8,19.28 20.47,19.28 19.83,19.92 12.85,19.92 12.7,19.77 v1(12.7,19.54)
SDA: length 40.2
  Top Layer w0.152: 12.57,18.52 12.81,18.76 S1.5
  Bottom Layer w0.152: v1(12.7,18.52) 12.95,18.27 13.59,18.27 14.99,19.67 19.73,19.67 20.36,19.03 21.7,19.03 23.6,17.13 30.99,17.13 32.13,15.98 32.13,8.98 38.43,2.68 H1.11
SPI1_MISO: length 33.3
  Top Layer w0.152: S1.17 15.65,15.76 16.17,16.28 16.17,19.33 17.65,20.81 40.39,20.81 41.02,21.44 41.02,23.45 H2.12
SPI1_MOSI: length 27.1
  Top Layer w0.152: H2.10 35.94,23.45 35.94,21.95 35.31,21.32 17.44,21.32 15.66,19.54 15.66,17.17 15.25,16.76 S1.13
SPI1_SCK: length 30.2
  Top Layer w0.152: H2.11 38.35,23.42 38.35,21.57 37.85,21.06 17.55,21.06 15.92,19.43 15.92,16.66 15.51,16.26 S1.15
SPI3_MISO: length 20.9
  Top Layer w0.152: H2.8 30.81,22.41 30.23,21.83 17.23,21.83 15.16,19.75 15.16,18.06 14.85,17.76 S1.9
SPI3_MOSI: length 23.9
  Top Layer w0.152: S1.11 14.99,17.26 15.41,17.68 15.41,19.64 17.34,21.57 32.64,21.57 33.4,22.33 33.4,23.45 H2.9
SPI3_SCK: length 17.9
  Top Layer w0.152: H2.7 28.32,23.45 28.32,22.59 27.81,22.08 17.13,22.08 14.9,19.85 14.9,18.56 14.59,18.26 S1.7
SWCLK: length 45.9
  Top Layer w0.152: S1.35 33.54,10.53 29.84,6.84 29.84,4.81 29.21,4.17 18.41,4.17 17.91,4.68 v1(17.91,9.38)
  Bottom Layer w0.152: 5.46,12.43 v1(5.59,12.43) 5.84,12.68 5.84,13.85 7.09,15.1 10.89,15.1 12,13.99 12,10.08 12.7,9.38 v1(17.91,9.38)
SWDIO: length 46
  Top Layer w0.152: v1(18.54,8.74) 18.54,4.93 19.05,4.43 28.96,4.43 29.46,4.93 29.46,6.97 33.53,11.03 S1.33
  Bottom Layer w0.152: v1(18.54,8.74) 12.83,8.74 11.68,9.89 11.68,13.95 10.79,14.85 7.25,14.85 6.22,13.82 6.22,11.79 5.97,11.54 v1(5.59,11.54)
UART1_RX: length 31.9
  Top Layer w0.152: v1(29.21,16.36) R8.2 ; v1(19.94,17.38) 19.31,16.76 S1.14
  Bottom Layer w0.152: v1(19.94,17.38) 20.32,17.76 22.61,17.76 23.62,16.75 28.83,16.75 v1(29.21,16.36) 29.72,15.86 31.24,15.86 31.88,15.22 31.88,8.87 35.89,4.86 H1.10
UART1_TX: length 32.5
  Top Layer w0.152: U5.25 27.69,14.86 v1(27.69,15.73) ; S1.16 19.96,16.26 v1(20.7,17)
  Bottom Layer w0.152: H1.9 34.41,1.5 35.56,2.65 35.56,4.83 31.62,8.77 31.62,14.97 31.12,15.47 27.94,15.47 v1(27.69,15.73) 23.75,15.73 22.48,17 v1(20.7,17)
UART4_RX: length 19.1
  Top Layer w0.152: v1(27.56,19.67) 27.56,18.65 23.66,14.76 S1.22
  Bottom Layer w0.152: H2.5 24.74,21.95 26.67,21.95 27.56,21.06 v1(27.56,19.67)
UART4_TX: length 18.1
  Top Layer w0.152: v1(28.19,19.16) 28.19,18.65 23.8,14.26 S1.24
  Bottom Layer w0.152: H2.6 28.19,21.04 v1(28.19,19.16)
UART5_RX: length 21
  Top Layer w0.152: S1.18 23.39,15.76 26.29,18.65 v1(26.29,19.67)
  Bottom Layer w0.152: v1(26.29,19.67) 26.29,20.68 25.91,21.06 20.89,21.06 19.24,22.71 18.9,22.71 H2.3
UART5_TX: length 20.6
  Top Layer w0.152: S1.20 23.53,15.26 26.92,18.65 v1(26.92,19.16)
  Bottom Layer w0.152: H2.4 20.65,22.77 21.84,21.57 26.42,21.57 26.92,21.06 v1(26.92,19.16)
USB_DM: length 18.5
  Top Layer w0.152: USB1.B7 45.6,17.76 46.58,17.76 46.74,17.91 v1(46.74,18.26) 46.74,18.6 46.58,18.75 USB1.A7 ; v1(37.59,12.05) 37.58,12.03 S1.29
  Bottom Layer w0.152: v1(46.74,18.26) 46.24,17.76 42.93,17.76 42.29,17.13 42.29,13.44 40.89,12.05 v1(37.59,12.05)
USB_DP: length 23
  Top Layer w0.152: S1.31 37.34,11.53 v1(37.59,11.28) ; v1(46.86,19.41) 46.7,19.25 USB1.B6 45.55,19.28 44.73,19.28 44.58,19.13 44.58,18.4 44.73,18.25 USB1.A6
  Bottom Layer w0.152: v1(46.86,19.41) 47.5,19.41 47.75,19.16 47.75,17.63 47.5,17.38 43.56,17.38 42.67,16.49 42.67,13.19 40.77,11.28 v1(37.59,11.28)
$1N7194: length 2.3
  Top Layer w0.152: USB1.B5 44.75,20.25 44.32,20.68 R4.2
$1N7198: length 4.1
  Top Layer w0.152: USB1.A5 44.86,17.25 44.07,18.04 44.07,19.54 43.77,19.84 R3.2
$1N7820: length 1.2
  Top Layer w0.254: C3.2 36.75,18.34 U4.4
$1N8064: length 2.6
  Top Layer w0.152: U5.9 26.65,9.62 26.89,9.38 27.94,9.38 28.19,9.12 R7.1
$1N8083: length 1.6
  Top Layer w0.152: R8.1 27.15,16.34 U5.26
$1N8290: length 4.1
  Top Layer w0.152: USB2.B5 44.21,8.25 43.94,7.98 43.94,6.2 43.69,5.95 R9.1
$1N8294: length 3
  Top Layer w0.152: USB2.A5 44.64,5.25 44.58,5.19 44.58,4.55 44.2,4.17 R10.2
$1N8566: length 0.9
  Top Layer w0.254: R11.2 43.43,7.86
$1N8614: length 0.8
  Top Layer w0.254: D2.1 R12.2

## Copper pours and planes (outline as drawn; the poured copper is in the pictures)
GND on Top Layer: -0.47,25.58 53.25,25.58 53.25,-0.58 -0.47,-0.58
GND on Bottom Layer: -0.38,25.64 53.34,25.64 53.34,-0.53 -0.38,-0.53

Small or netless copper shapes (teardrops, artwork), in the pictures only: 216 on Top Layer, 102 on Bottom Layer

## Text on the board
Bottom Silkscreen Layer: GND | PC1 | PC14 | 3V3 | PB0 | PA6 | PC0 | PA4 | PB1 | PC13 | RX5 | TX5 | RX4 | TX4 | SCK | SPI3 | MISO | MOSI | SPI1 | Designed by | AGND | 5V | ADC2 | ADC1 | ADC3 | ADC4 | TX1 | RX1 | SDA | SCL | V1.0 | H | L | CAN1 | CAN2 | XiaoHai | USB | UART | KEY | RST
